# Altium schematic sheet 5 line.SchDoc
size A4
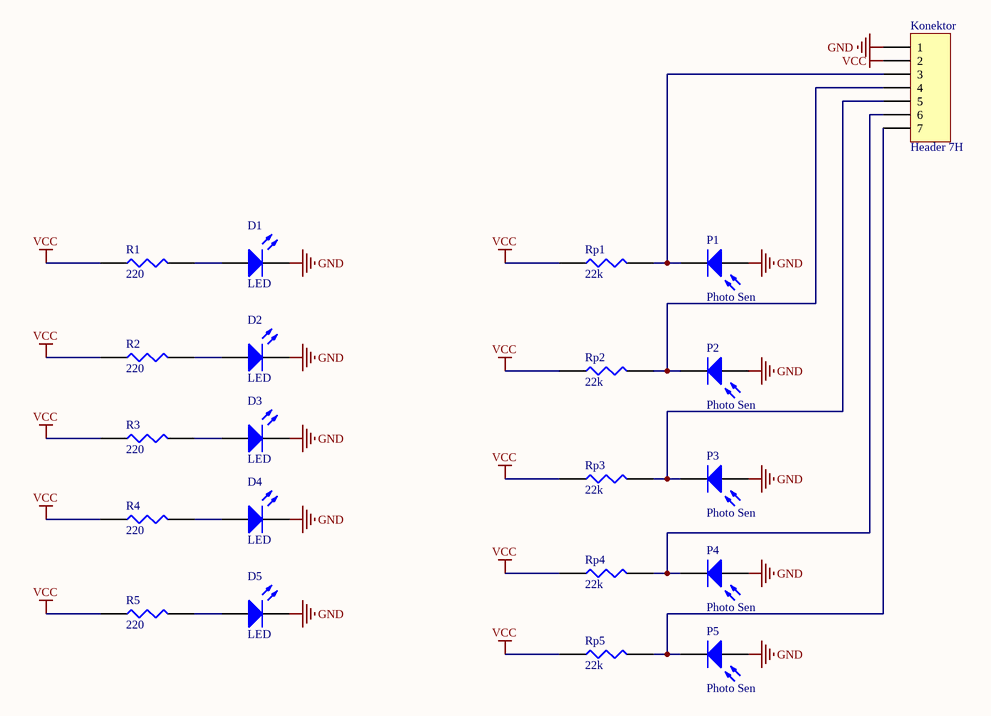
[diagram p0: 5 line.SchDoc]

## Parts
D1  LED  [My_LED3MM]
D2  LED  [My_LED3MM]
D3  LED  [My_LED3MM]
D4  LED  [My_LED3MM]
D5  LED  [My_LED3MM]
Konektor  Header 7H  [HDR1X7H]
P1  Photo Sen  [PIN2]
P2  Photo Sen  [PIN2]
P3  Photo Sen  [PIN2]
P4  Photo Sen  [PIN2]
P5  Photo Sen  [PIN2]
R1  value 220  [My_axial-0.4]  (hidden comment: 1k)
R2  value 220  [My_axial-0.4]  (hidden comment: 1k)
R3  value 220  [My_axial-0.4]  (hidden comment: 1k)
R4  value 220  [My_axial-0.4]  (hidden comment: 1k)
R5  value 220  [My_axial-0.4]  (hidden comment: 1k)
Rp1  value 22k  [My_axial-0.4]  (hidden comment: 1k)
Rp2  value 22k  [My_axial-0.4]  (hidden comment: 1k)
Rp3  value 22k  [My_axial-0.4]  (hidden comment: 1k)
Rp4  value 22k  [My_axial-0.4]  (hidden comment: 1k)
Rp5  value 22k  [My_axial-0.4]  (hidden comment: 1k)

## Nets
GND: D1.K D2.K D3.K D4.K D5.K Konektor.1 P1.1(A) P2.1(A) P3.1(A) P4.1(A) P5.1(A)
VCC: Konektor.2 R1.1 R2.1 R3.1 R4.1 R5.1 Rp1.1 Rp2.1 Rp3.1 Rp4.1 Rp5.1
NetD1_A: D1.A R1.2
NetD2_A: D2.A R2.2
NetD3_A: D3.A R3.2
NetD4_A: D4.A R4.2
NetD5_A: D5.A R5.2
NetKonektor_3: Konektor.3 P1.2(K) Rp1.2
NetKonektor_4: Konektor.4 P2.2(K) Rp2.2
NetKonektor_5: Konektor.5 P3.2(K) Rp3.2
NetKonektor_6: Konektor.6 P4.2(K) Rp4.2
NetKonektor_7: Konektor.7 P5.2(K) Rp5.2

## Library data of the parts
D1-D5 = LED: Typical INFRARED GaAs LED; Published: 8-Jun-2000; LatestRevisionDate: 08-Jul-2005; LatestRevisionNote: Mech Layer 1 removed.; Publisher: Altium Limited
Konektor = Header 7H: Header, 7-Pin, Right Angle; LatestRevisionDate: 17-Jul-2002; LatestRevisionNote: Re-released for DXP Platform.; Publisher: Altium Limited
P1-P5 = Photo Sen: Photosensitive Diode; Published: 24-Mar-1999; LatestRevisionDate: 17-Jul-2002; LatestRevisionNote: Re-released for DXP Platform.; PackageReference: PIN2; Publisher: Altium Limited
R1-R5 Rp1-Rp5 = Res: resistor 1/4 wat